# EAGLE design Zocalo-mcp2551-SOIC (EAGLE 7.4.0)
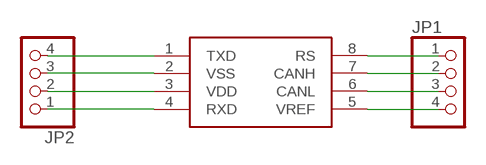
[diagram p0: schematic, sheet 1]

## Parts
JP1  PINHD-1X4  [1X04]
JP2  PINHD-1X4  [1X04]
U1  MCP2551  [SO08]

## Nets
N$1: JP2.4 U1.1(TXD)
N$2: JP2.3 U1.2(VSS)
N$3: JP2.2 U1.3(VDD)
N$4: JP2.1 U1.4(RXD)
N$5: JP1.1 U1.8(RS)
N$6: JP1.2 U1.7(CANH)
N$7: JP1.3 U1.6(CANL)
N$8: JP1.4 U1.5(VREF)

## Library data of the parts
JP1 JP2 = pinhead:PINHD-1X4: PIN HEADER
U1 = SparkFun:MCP2551

## Board
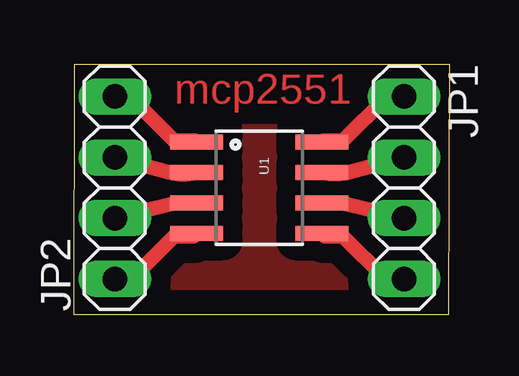
[diagram p1: board, top side]

Size 15.68 x 10.41 mm. Coordinates in mm from the lower left corner, seen from the top.
Outline: 0,0 15.65,0 15.68,10.4 0.03,10.4 0,0
Copper layers (1*16): Top 0.035mm / dielectric 1.5mm / Bottom 0.035mm
Design rules "default": minimum track width 10mil, minimum drill 24mil, track to track 8mil, track to pad 8mil, pad to pad 8mil, via to via 8mil, smd to smd 8mil, copper to edge 40mil, drill to drill 8mil, minimum pad ring 10mil, minimum via ring 8mil, stop-mask expansion 4mil, vias tented up to drill 0mil, thermal gap 10mil

### Footprints (pad centres in the part's own frame; a part is rotated, then mirrored left to right if it is on the bottom)
1X04 = drill 1.016 long: 1 -3.81,0; 2 -1.27,0; 3 1.27,0; 4 3.81,0
SO08 = smd 0.61 x 2.21: 1 -1.905,-2.616; 2 -0.635,-2.616; 3 0.635,-2.616; 4 1.905,-2.616; 5 1.905,2.616; 6 0.635,2.616; 7 -0.635,2.616; 8 -1.905,2.616

### Placement (x,y rotation side)
JP1  13.78,5.27 270 top
JP2  1.71,5.27 90 top
U1  7.75,5.27 270 top

### Tracks (layer width: path | path; a pad name or v marks a point on that pad's centre or on a via)
N$1
  Top 0.61: JP2.4 2.35,9.08 4.19,7.24 5.07,7.24 U1.1
N$2
  Top 0.61: JP2.3 4,5.91 arc31 U1.2
N$3
  Top 0.61: JP2.2 4,4.57 arc-22 U1.3
N$4
  Top 0.61: JP2.1 2.41,1.46 4.19,3.24 5,3.24 U1.4
N$5
  Top 0.61: JP1.1 13.08,9.08 11.24,7.24 10.43,7.24 U1.8
N$6
  Top 0.61: JP1.2 11.43,5.91 arc-28 U1.7
N$7
  Top 0.61: JP1.3 11.43,4.57 arc19 U1.6
N$8
  Top 0.61: JP1.4 13.02,1.46 11.24,3.24 10.49,3.24 U1.5
N$9
  pour Top (isolate 0.813): 0,10.48 15.62,10.48 15.62,0 0,0

### Text on the board
Top: mcp2551